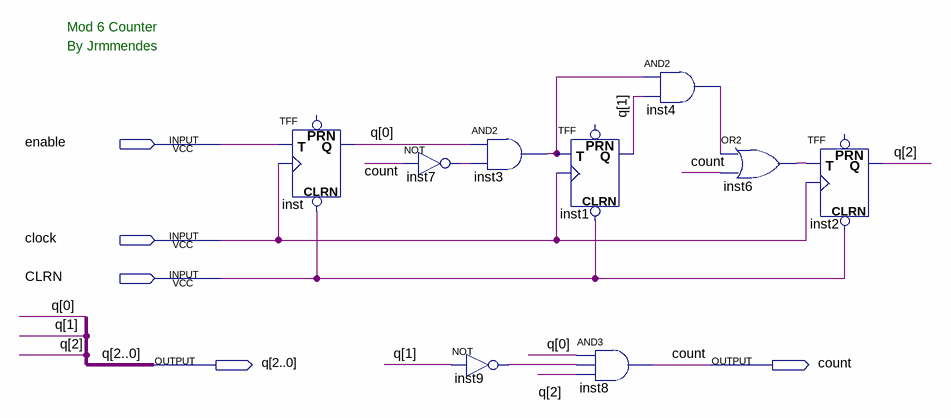
[diagram p0: schematic sheet]
// Quartus schematic mod_6_counter.bdf as structural Verilog: 9 symbols, 5 pins
module mod_6_counter (
  input  enable,
  input  clock,
  input  CLRN,
  output [2:0] q,
  output count
);

  wire inst3_out, inst4_out, inst6_out, inst7_out, inst9_out;

  TFF inst (.CLRN(CLRN), .T(enable), .CLK(clock), .Q(q[0]));  // open: PRN
  not inst7 (inst7_out, count);
  and inst3 (inst3_out, q[0], inst7_out);
  not inst9 (inst9_out, q[1]);
  TFF inst1 (.CLRN(CLRN), .T(inst3_out), .CLK(clock), .Q(q[1]));  // open: PRN
  and inst8 (count, q[0], inst9_out, q[2]);
  and inst4 (inst4_out, inst3_out, q[1]);
  or inst6 (inst6_out, inst4_out, count);
  TFF inst2 (.CLRN(CLRN), .T(inst6_out), .CLK(clock), .Q(q[2]));  // open: PRN

  // Notes on the sheet:
  //   Mod 6 Counter
  //   By Jrmmendes
endmodule
